# EAGLE design sapog_reference_hardware (EAGLE 7.1.0)

## Sheet 1 of 2: page1
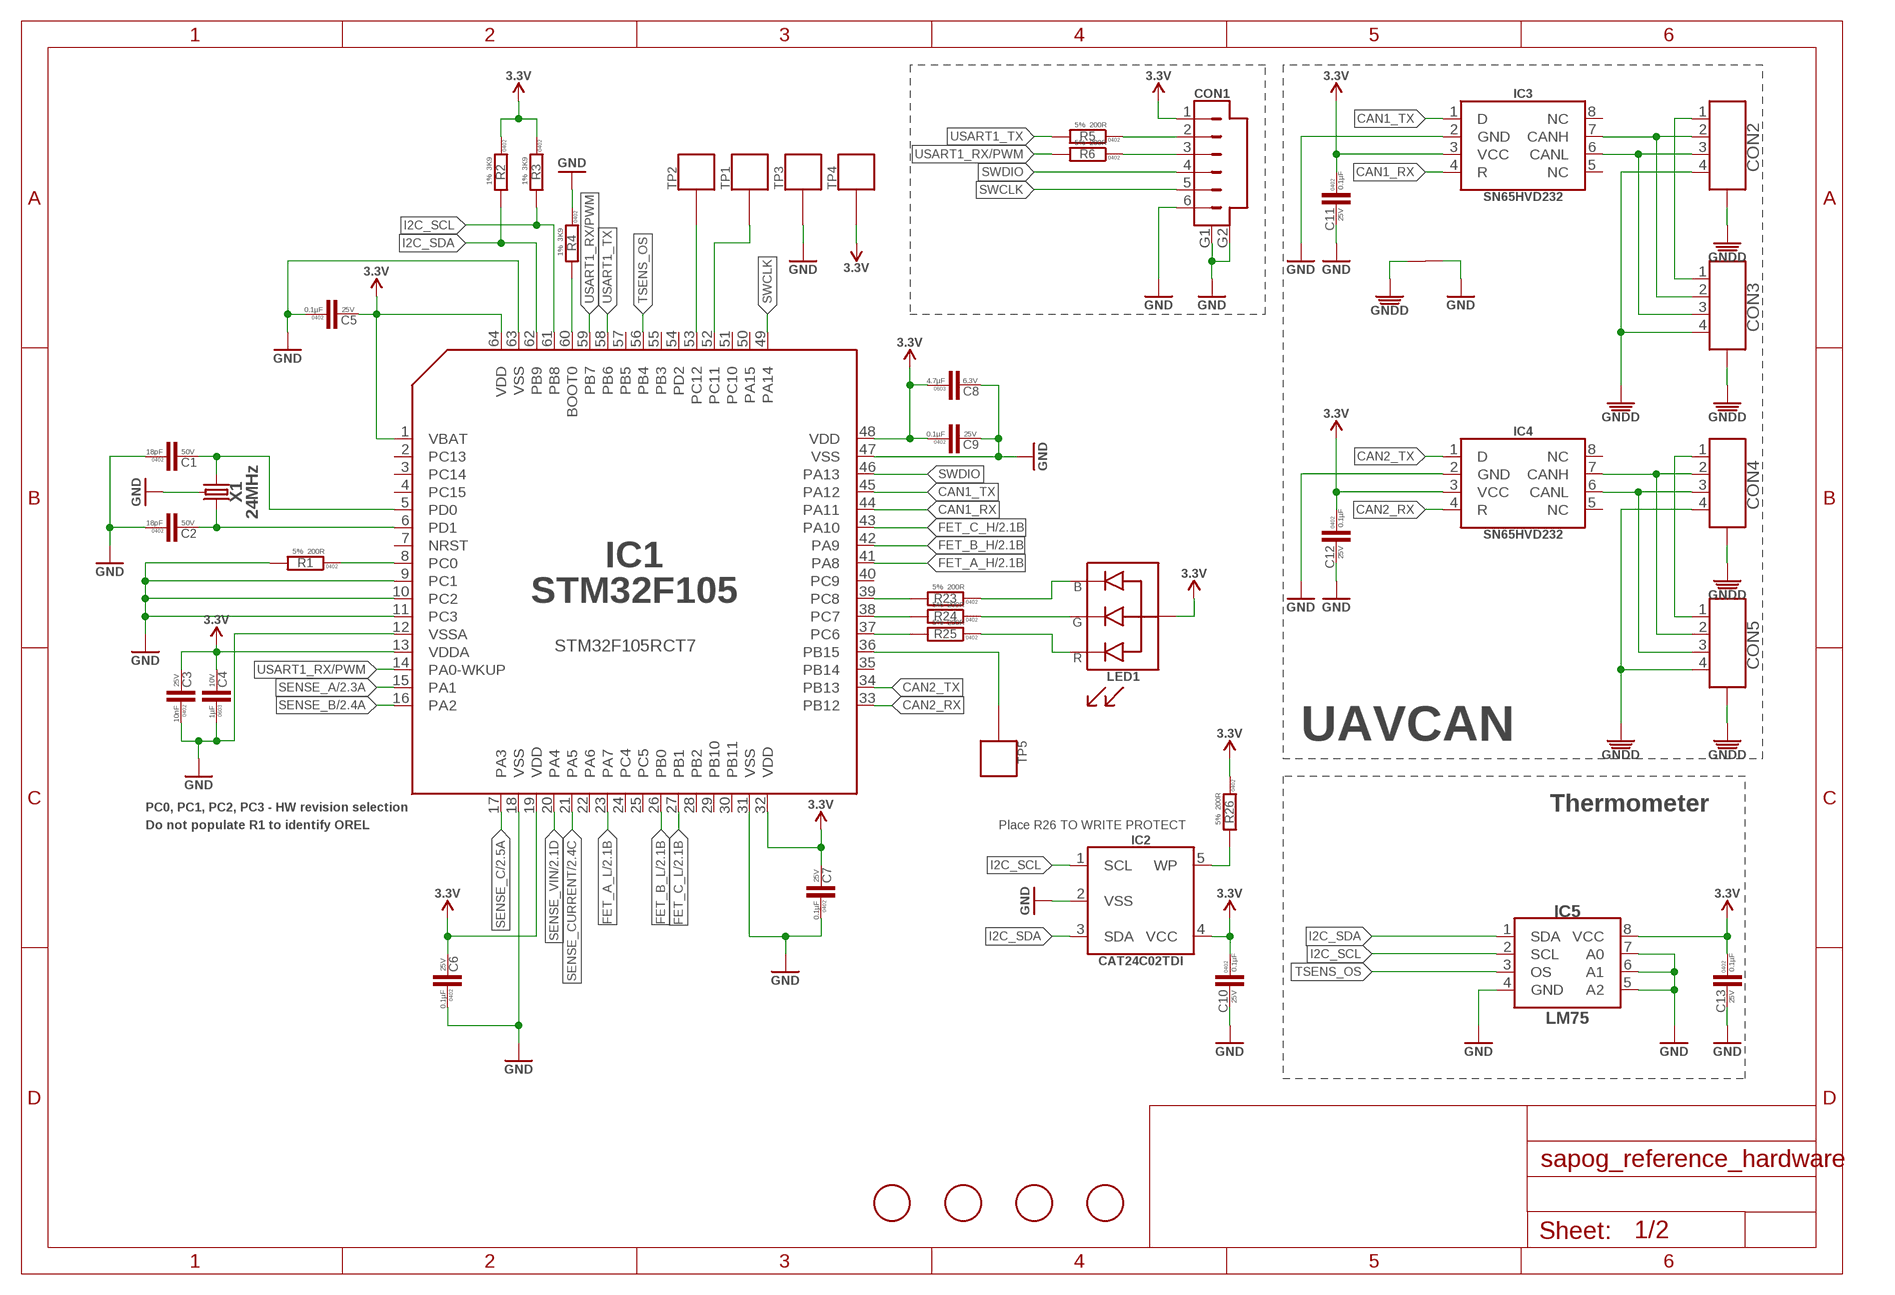
[diagram p0: schematic, sheet 1]

### Parts
C1  18pF  18PF-50V_5%_NP0-0402  [C0402]
C2  18pF  18PF-50V_5%_NP0-0402  [C0402]
C3  10nF  10NF-25V_10%_X7R-0402  [C0402]
C4  1µF  1µF-10V_10%_X7R-0603  [C0603]
C5  0.1µF  0.1µF-25V_20%_X6S-0402  [C0402]
C6  0.1µF  0.1µF-25V_20%_X6S-0402  [C0402]
C7  0.1µF  0.1µF-25V_20%_X6S-0402  [C0402]
C8  4.7µF  4.7µF-6.3V_10%_X7R-0603  [C0603]
C9  0.1µF  0.1µF-25V_20%_X6S-0402  [C0402]
C10  0.1µF  0.1µF-25V_20%_X6S-0402  [C0402]
C11  0.1µF  0.1µF-25V_20%_X6S-0402  [C0402]
C12  0.1µF  0.1µF-25V_20%_X6S-0402  [C0402]
C13  0.1µF  0.1µF-25V_20%_X6S-0402  [C0402]
CON1  SM06B-SRSS-TB  [SM06B]
CON2  CON-4P-RA-JST_GH  [JST_GH-4P-RA]
CON3  CON-4P-RA-JST_GH  [JST_GH-4P-RA]
CON4  CON-4P-RA-JST_GH  [JST_GH-4P-RA]
CON5  CON-4P-RA-JST_GH  [JST_GH-4P-RA]
FD1  FIDUCIALMOUNT  [FIDUCIA-MOUNT]
FD2  FIDUCIALMOUNT  [FIDUCIA-MOUNT]
FD3  FIDUCIALMOUNT  [FIDUCIA-MOUNT]
FD4  FIDUCIALMOUNT  [FIDUCIA-MOUNT]
IC1  STM32F105  [TQFP64-10X10]
IC2  CAT24C02  [SOT23-5L]
IC3  SN65HVD232D  [SOIC8]
IC4  SN65HVD232D  [SOIC8]
IC5  LM75BD-TSSOP8  [TSSOP8]
LED1  LTST-C19HE1WT  [LITE_ON_RGB_LED]
R1  200R  200R-5%-0402  [R0402]
R2  3K9  3K9-1%-0402  [R0402]
R3  3K9  3K9-1%-0402  [R0402]
R4  3K9  3K9-1%-0402  [R0402]
R5  200R  200R-5%-0402  [R0402]
R6  200R  200R-5%-0402  [R0402]
R23  200R  200R-5%-0402  [R0402]
R24  200R  200R-5%-0402  [R0402]
R25  200R  200R-5%-0402  [R0402]
R26  200R  200R-5%-0402  [R0402]
TP1  PAD.05  [PAD.05X.05]
TP2  PAD.05  [PAD.05X.05]
TP3  PAD.05  [PAD.05X.05]
TP4  PAD.05  [PAD.05X.05]
TP5  PAD.05  [PAD.05X.05]
U$2  CONNECTION  [CONNECTION]
X1  24MHz  CRYSTAL-3.2X2.5-4P  [OSCILLATOR-3.2X2.5]

### Nets
BOOT0: IC1.60(BOOT0) R4.2
CAN1_RX: IC1.44(PA11) IC3.4(R)
CAN1_TX: IC1.45(PA12) IC3.1(D)
CAN2_RX: IC1.33(PB12) IC4.4(R)
CAN2_TX: IC1.34(PB13) IC4.1(D)
FET_A_H: IC1.41(PA8) ; also sheet 2
FET_A_L: IC1.23(PA7) ; also sheet 2
FET_B_H: IC1.42(PA9) ; also sheet 2
FET_B_L: IC1.26(PB0) ; also sheet 2
FET_C_H: IC1.43(PA10) ; also sheet 2
FET_C_L: IC1.27(PB1) ; also sheet 2
GND: C1.1 C2.1 C3.1 C4.P$1 C5.1 C6.1 C7.1 C8.P$2 C9.2 C10.2 C11.2 C12.2 C13.2 CON1.6 CON1.G1 CON1.G2 IC1.9(PC1) IC1.10(PC2) IC1.11(PC3) IC1.12(VSSA) IC1.18(VSS) IC1.31(VSS) IC1.47(VSS) IC1.63(VSS) IC2.2(VSS) IC3.2(GND) IC4.2(GND) IC5.4(GND) IC5.5(A2) IC5.6(A1) IC5.7(A0) R1.2 R4.1 TP3.P$1 U$2.P$2 X1.2(GND) X1.4(GND) ; also sheet 2
GNDD: CON2.4 CON2.M$0(GND) CON2.M$1(GND) CON3.4 CON3.M$0(GND) CON3.M$1(GND) CON4.4 CON4.M$0(GND) CON4.M$1(GND) CON5.4 CON5.M$0(GND) CON5.M$1(GND) U$2.P$1
I2C_SCL: IC1.61(PB8) IC2.1(SCL) IC5.2(SCL) R3.2
I2C_SDA: IC1.62(PB9) IC2.3(SDA) IC5.1(SDA) R2.2
N$1: CON1.2 R5.1
N$2: CON1.3 R6.1
N$3: IC1.37(PC6) R25.2
N$6: LED1.B R23.1
N$7: LED1.R R25.1
N$9: IC1.8(PC0) R1.1
N$10: IC2.5(WP) R26.2
N$12: IC1.38(PC7) R24.2
N$16: C1.2 IC1.5(PD0) X1.3
N$18: IC1.39(PC8) R23.2
N$19: CON4.1 CON5.1
N$20: CON4.2 CON5.2 IC4.7(CANH)
N$21: C2.2 IC1.6(PD1) X1.1
N$22: CON2.1 CON3.1
N$23: CON2.2 CON3.2 IC3.7(CANH)
N$24: CON4.3 CON5.3 IC4.6(CANL)
N$25: CON2.3 CON3.3 IC3.6(CANL)
N$26: LED1.G R24.1
N$27: IC1.53(PC12) TP2.P$1
N$28: IC1.36(PB15) TP5.P$1
N$29: IC1.52(PC11) TP1.P$1
SENSE_A: IC1.15(PA1) ; also sheet 2
SENSE_B: IC1.16(PA2) ; also sheet 2
SENSE_C: IC1.17(PA3) ; also sheet 2
SENSE_CURRENT: IC1.21(PA5) ; also sheet 2
SENSE_VIN: IC1.20(PA4) ; also sheet 2
SWCLK: CON1.5 IC1.49(PA14)
SWDIO: CON1.4 IC1.46(PA13)
TSENS_OS: IC1.56(PB4) IC5.3(OS)
USART1_RX/PWM: IC1.14(PA0-WKUP) IC1.59(PB7) R6.2
USART1_TX: IC1.58(PB6) R5.2
VDD_3V3: C3.2 C4.P$2 C5.2 C6.2 C7.2 C8.P$1 C9.1 C10.1 C11.1 C12.1 C13.1 CON1.1 IC1.1(VBAT) IC1.13(VDDA) IC1.19(VDD) IC1.32(VDD) IC1.48(VDD) IC1.64(VDD) IC2.4(VCC) IC3.3(VCC) IC4.3(VCC) IC5.8(VCC) LED1.+(A) R2.1 R3.1 R26.1 TP4.P$1 ; supply symbol labelled 3.3V ; also sheet 2
Unconnected: IC1.2(PC13) IC1.3(PC14) IC1.4(PC15) IC1.7(NRST) IC1.22(PA6) IC1.24(PC4) IC1.25(PC5) IC1.28(PB2) IC1.29(PB10) IC1.30(PB11) IC1.35(PB14) IC1.40(PC9) IC1.50(PA15) IC1.51(PC10) IC1.54(PD2) IC1.55(PB3) IC1.57(PB5) IC3.5(NC) IC3.8(NC) IC4.5(NC) IC4.8(NC)

### Notes on the sheet
- STM32F105RCT7
- UAVCAN
- PC0, PC1, PC2, PC3 - HW revision selection | Thermometer
- Do not populate R1 to identify OREL | Place R26 TO WRITE PROTECT

## Sheet 2 of 2
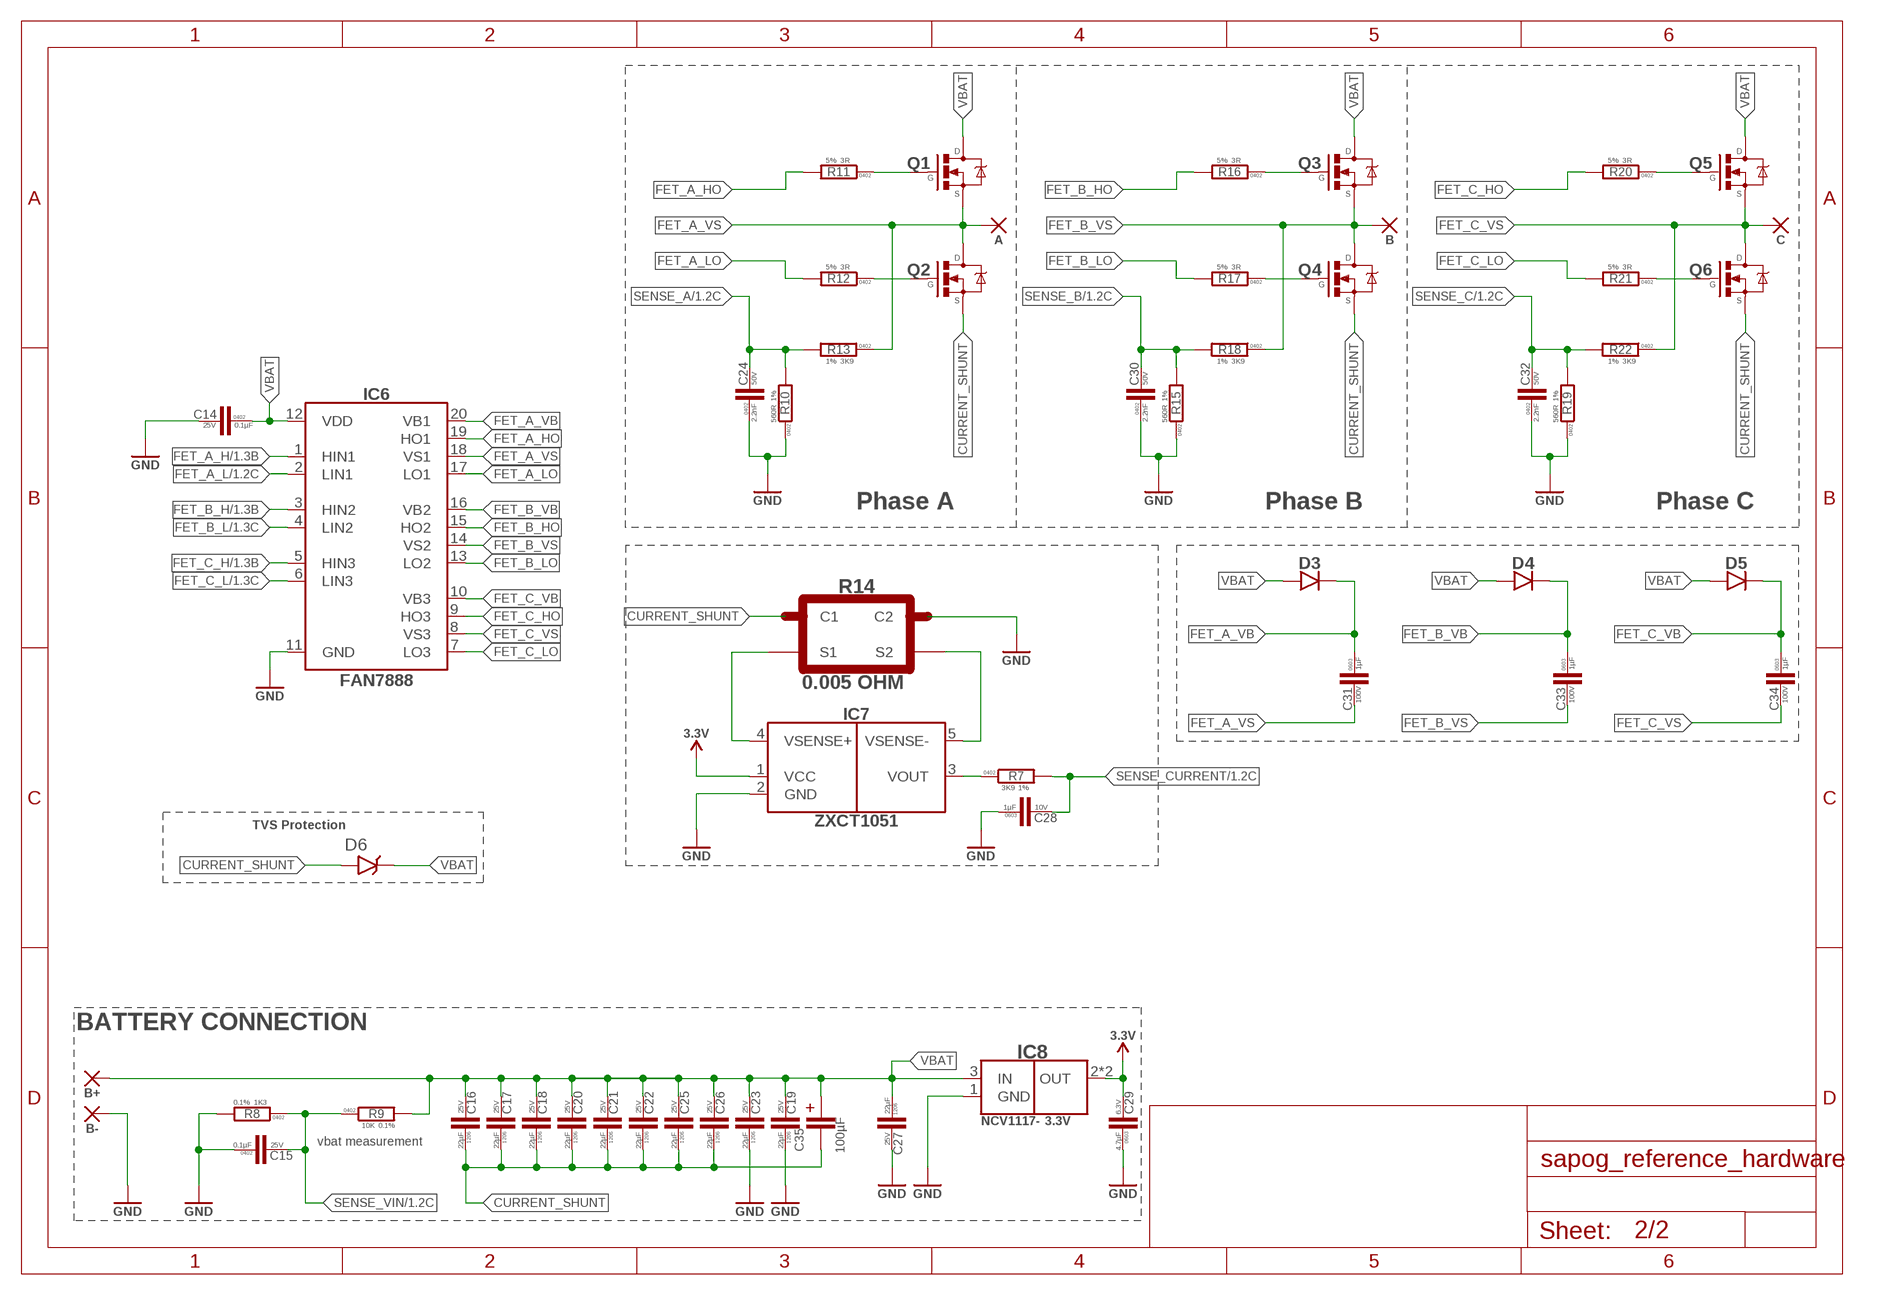
[diagram p1: schematic, sheet 2]

### Parts
A  WIREPADSMD5-2,5  [5-2,5]
B  WIREPADSMD5-2,5  [5-2,5]
B+  WIREPADSMD5-2,5  [5-2,5]
B-  WIREPADSMD5-2,5  [5-2,5]
C  WIREPADSMD5-2,5  [5-2,5]
C14  0.1µF  0.1µF-25V_20%_X6S-0402  [C0402]
C15  0.1µF  0.1µF-25V_20%_X6S-0402  [C0402]
C16  22µF  22µF-25V_10%_X6S-1206  [C1206]
C17  22µF  22µF-25V_10%_X6S-1206  [C1206]
C18  22µF  22µF-25V_10%_X6S-1206  [C1206]
C19  22µF  22µF-25V_10%_X6S-1206  [C1206]
C20  22µF  22µF-25V_10%_X6S-1206  [C1206]
C21  22µF  22µF-25V_10%_X6S-1206  [C1206]
C22  22µF  22µF-25V_10%_X6S-1206  [C1206]
C23  22µF  22µF-25V_10%_X6S-1206  [C1206]
C24  2.2nF  2.2NF-50V_10%_X7R-0402  [C0402]
C25  22µF  22µF-25V_10%_X6S-1206  [C1206]
C26  22µF  22µF-25V_10%_X6S-1206  [C1206]
C27  22µF  22µF-25V_10%_X6S-1206  [C1206]
C28  1µF  1µF-10V_10%_X7R-0603  [C0603]
C29  4.7µF  4.7µF-6.3V_10%_X7R-0603  [C0603]
C30  2.2nF  2.2NF-50V_10%_X7R-0402  [C0402]
C31  1µF  1µF-100V_10%_X7S-0603  [C0603]
C32  2.2nF  2.2NF-50V_10%_X7R-0402  [C0402]
C33  1µF  1µF-100V_10%_X7S-0603  [C0603]
C34  1µF  1µF-100V_10%_X7S-0603  [C0603]
C35  100µF  C-TANT-3024  [3024]
D3  BAS21AHT1G  [SOD323]
D4  BAS21AHT1G  [SOD323]
D5  BAS21AHT1G  [SOD323]
D6  1KSMB20A  [SMB]
IC6  FAN7888  [SOIC20]
IC7  ZXCT1051  [SOT23-5L]
IC8  3.3V  NCV1117-3.3  [SOT-223]
Q1  BSC019N04NS-DFN5X6  [DFN5X6]
Q2  BSC019N04NS-DFN5X6  [DFN5X6]
Q3  BSC019N04NS-DFN5X6  [DFN5X6]
Q4  BSC019N04NS-DFN5X6  [DFN5X6]
Q5  BSC019N04NS-DFN5X6  [DFN5X6]
Q6  BSC019N04NS-DFN5X6  [DFN5X6]
R7  3K9  3K9-1%-0402  [R0402]
R8  1K3  1K3-0.1%-0402  [R0402]
R9  10K  10K-0.1%-0402  [R0402]
R10  560R  560R-1%-0402  [R0402]
R11  3R  3R-5%-0402  [R0402]
R12  3R  3R-5%-0402  [R0402]
R13  3K9  3K9-1%-0402  [R0402]
R14  0.005 OHM  CURRENT_SHUNT-CSNL2010  [2010_CURRENT_SHUNT]
R15  560R  560R-1%-0402  [R0402]
R16  3R  3R-5%-0402  [R0402]
R17  3R  3R-5%-0402  [R0402]
R18  3K9  3K9-1%-0402  [R0402]
R19  560R  560R-1%-0402  [R0402]
R20  3R  3R-5%-0402  [R0402]
R21  3R  3R-5%-0402  [R0402]
R22  3K9  3K9-1%-0402  [R0402]

### Nets
BLABLA: IC7.3(VOUT) R7.1
CURRENT_SHUNT: C16.P$1 C17.P$1 C18.P$1 C20.P$1 C21.P$1 C22.P$1 C25.P$1 C26.P$1 C35.- D6.A Q2.1S(S) Q2.2S(S) Q2.3S(S) Q4.1S(S) Q4.2S(S) Q4.3S(S) Q6.1S(S) Q6.2S(S) Q6.3S(S) R14.CURRENT1(C1)
FET_A_H: IC6.1(HIN1) ; also sheet 1
FET_A_HO: IC6.19(HO1) R11.2
FET_A_L: IC6.2(LIN1) ; also sheet 1
FET_A_LO: IC6.17(LO1) R12.2
FET_A_VB: C31.P$1 D3.C IC6.20(VB1)
FET_A_VS: A.1(P) C31.P$2 IC6.18(VS1) Q1.1S(S) Q1.2S(S) Q1.3S(S) Q2.5D(D) Q2.6D(D) Q2.7D(D) Q2.8D(D) R13.1
FET_B_H: IC6.3(HIN2) ; also sheet 1
FET_B_HO: IC6.15(HO2) R16.2
FET_B_L: IC6.4(LIN2) ; also sheet 1
FET_B_LO: IC6.13(LO2) R17.2
FET_B_VB: C33.P$1 D4.C IC6.16(VB2)
FET_B_VS: B.1(P) C33.P$2 IC6.14(VS2) Q3.1S(S) Q3.2S(S) Q3.3S(S) Q4.5D(D) Q4.6D(D) Q4.7D(D) Q4.8D(D) R18.1
FET_C_H: IC6.5(HIN3) ; also sheet 1
FET_C_HO: IC6.9(HO3) R20.2
FET_C_L: IC6.6(LIN3) ; also sheet 1
FET_C_LO: IC6.7(LO3) R21.2
FET_C_VB: C34.P$1 D5.C IC6.10(VB3)
FET_C_VS: C34.P$2 C.1(P) IC6.8(VS3) Q5.1S(S) Q5.2S(S) Q5.3S(S) Q6.5D(D) Q6.6D(D) Q6.7D(D) Q6.8D(D) R22.1
GND: B-.1(P) C14.2 C15.1 C19.P$1 C23.P$1 C24.1 C27.P$2 C28.P$1 C29.P$1 C30.1 C32.1 IC6.11(GND) IC7.2(GND) IC8.1(GND) R8.2 R10.1 R14.CURRENT2(C2) R15.1 R19.1 ; also sheet 1
N$4: Q2.4G(G) R12.1
N$5: Q3.4G(G) R16.1
N$8: Q4.4G(G) R17.1
N$11: Q5.4G(G) R20.1
N$13: IC7.5(VSENSE-) R14.SENSE2(S2)
N$14: Q1.4G(G) R11.1
N$15: IC7.4(VSENSE+) R14.SENSE1(S1)
N$17: Q6.4G(G) R21.1
SENSE_A: C24.2 R10.2 R13.2 ; also sheet 1
SENSE_B: C30.2 R15.2 R18.2 ; also sheet 1
SENSE_C: C32.2 R19.2 R22.2 ; also sheet 1
SENSE_CURRENT: C28.P$2 R7.2 ; also sheet 1
SENSE_VIN: C15.2 R8.1 R9.1 ; also sheet 1
VBAT: B+.1(P) C14.1 C16.P$2 C17.P$2 C18.P$2 C19.P$2 C20.P$2 C21.P$2 C22.P$2 C23.P$2 C25.P$2 C26.P$2 C27.P$1 C35.+ D3.A D4.A D5.A D6.C IC6.12(VDD) IC8.3(IN) Q1.5D(D) Q1.6D(D) Q1.7D(D) Q1.8D(D) Q3.5D(D) Q3.6D(D) Q3.7D(D) Q3.8D(D) Q5.5D(D) Q5.6D(D) Q5.7D(D) Q5.8D(D) R9.2
VDD_3V3: C29.P$2 IC7.1(VCC) IC8.2(OUT) IC8.4(OUT) ; supply symbol labelled 3.3V ; also sheet 1

### Notes on the sheet
- Phase A | Phase B | Phase C
- TVS Protection
- BATTERY CONNECTION
- vbat measurement

## Library data of the parts
A B B+ B- C = valenok_master_library:WIREPAD: Wire PAD connect wire on PCB
C1 C2 = C_digikey:18PF; DIGIKEY#: 399-8828-1-ND; MANF: Kemet; MANF#: CBR04C180F5GAC; OPERATING_TEMP: -55°C ~ 125°C; PACKAGE: 0402; TC: C0G, NP0; TOLERANCE: +-1%; VOLTAGE: 50V
C3 = C_digikey:10NF; DIGIKEY#: 490-1312-1-ND; MANF: Murata Electronics North America; MANF#: GRM155R71E103KA01D; OPERATING_TEMP: -55°C ~ 125°C; PACKAGE: 0402; TC: X7R; TOLERANCE: +-10%; VOLTAGE: 25V
C4 C28 = C_digikey:1µF; DIGIKEY#: 587-1242-1-ND; MANF: Taiyo Yuden; MANF#: LMK107B7105KA-T; OPERATING_TEMP: -55°C ~ 125°C; PACKAGE: 0603; TC: X7R; TOLERANCE: +-10%; VOLTAGE: 10V
C5-C7 C9-C15 = C_digikey:0.1µF; DIGIKEY#: 445-7361-1-ND; MANF: TDK Corporation; MANF#: C1005X6S1E104M050BB; OPERATING_TEMP: -55°C ~ 105°C; PACKAGE: 0402; TC: X6S; TOLERANCE: +-20%; VOLTAGE: 25V
C8 C29 = C_digikey:4.7µF; DIGIKEY#: 1276-2087-1-ND; MANF: Samsung Electro-Mechanics America; MANF#: CL10B475KQ8NQNC; OPERATING_TEMP: -55°C ~ 125°C; PACKAGE: 0603; TC: X7R; TOLERANCE: +-10%; VOLTAGE: 6.3V
C16-C23 C25-C27 = C_digikey:22µF; DIGIKEY#: 1276-3299-1-ND; MANF: Samsung Electro-Mechanics America; MANF#: CL31X226KAHN3NE; OPERATING_TEMP: -55°C ~ 105°C; PACKAGE: 1206; TC: X6S; TOLERANCE: +-10%; VOLTAGE: 25V
C24 C30 C32 = C_digikey:2.2NF; DIGIKEY#: 478-1105-1-ND; MANF: AVX Corporation; MANF#: 04025C222KAT2A; OPERATING_TEMP: -55°C ~ 125°C; PACKAGE: 0402; TC: X7R; TOLERANCE: +-10%; VOLTAGE: 50V
C31 C33 C34 = C_digikey:1µF; DIGIKEY#: 445-5205-1-ND; MANF: TDK Corporation; MANF#: C2012X7S2A105K125AB; OPERATING_TEMP: -55°C ~ 125°C; PACKAGE: 0603; TC: X7S; TOLERANCE: +-10%; VOLTAGE: 100V
C35 = sapog_reference_hardware:C-TANT: Tantalum capacitor; DIGIKEY#: 718-1942-1-ND; MANF: Vishay Sprague; MANF#: 597D107X0035F2T; OPERATING_TEMPERATURE: -55°C ~ 125°C; VOLTAGE: 35V
CON1 = sapog_reference_hardware:SM06B-SRSS-TB: CONN HEADER SH 6POS SIDE 1MM TIN; DIGIKEY#: 455-1806-1-ND; MANF: JST Sales America Inc; MANF#: SM06B-SRSS-TB(LF)(SN); PARTNO: SM06B-SRSS-TB
CON2-CON5 = sapog_reference_hardware:CON-4P-RA: Connector Receptacle 4 Position 0.049" (1.25mm) Tin Surface Mount, Right Angle; DIGIKEY#: 455-1566-1-ND; MANF: JST Sales America Inc; MANF#: SM04B-GHS-TB(LF)(SN)-
D3-D5 = valenok_master_library:BAS21AHT1G: DIODE GEN PURP 250V 200MA SOD323; DIGIKEY#: BAS21AHT1GOSCT-ND; MANF: ON Semiconductor; MANF#: BAS21AHT1G
D6 = sapog_reference_hardware:1KSMB20A: TVS DIODE 17.1VWM 27.7VC SMD; DIGIKEY#: 1KSMB20ACT-ND; MANF: Littelfuse Inc; MANF#: 1KSMB20A
FD1-FD4 = sapog_reference_hardware:FIDUCIALMOUNT
IC1 = sapog_reference_hardware:STM32F105: MCU ARM 256KB FLASH MEM 64-LQFP; DIGIKEY#: 497-11547-ND; MANF: STMicroelectronics; MANF#: STM32F105RCT7; OPERATING_TEMP: -40°C ~ 105°C (TA)
IC2 = sapog_reference_hardware:CAT24C02: IC EEPROM 2KBIT 400KHZ TSOT23-5; DIGIKEY#: CAT24C02TDI-GT3AOSCT-ND; MANF: ON Semiconductor; MANF#: CAT24C02TDI-GT3A
IC3 IC4 = sapog_reference_hardware:SN65HVD232D: IC CAN TRANSCEIVER 3.3V 8-SOIC; DIGIKEY#: 296-26344-1-ND; MANF: Texas Instruments; MANF#: SN65HVD232DR
IC5 = sapog_reference_hardware:LM75BD: SENSOR TEMPERATURE I2C 8TSSOP; DIGIKEY#: 568-4768-1-ND; MANF: NXP Semiconductors; MANF#: LM75BDP,118
IC6 = sapog_reference_hardware:FAN7888: IC GATE DRIVER HALF BRIDG 20SOIC; DIGIKEY#: FAN7888MXTR-ND; MANF: Fairchild Semiconductor; MANF#: FAN7888MX; PARTNO: FAN7888MX
IC7 = sapog_reference_hardware:ZXCT1051: IC CURRENT MONITOR 1% SOT23-5; DIGIKEY#: ZXCT1051E5CT-ND; MANF: Diodes Incorporated; MANF#: ZXCT1051E5TA
IC8 = sapog_reference_hardware:NCV1117-3.3: IC REG LDO 3.3V 1A SOT223; DIGIKEY#: NCV1117ST33T3GOSCT-ND; MANF: ON Semiconductor; MANF#: NCV1117ST33T3G
LED1 = sapog_reference_hardware:LTST-C19HE1WT; DIGIKEY#: 160-2162-1-ND; MANF#: LTST-C19HE1WT
Q1-Q6 = sapog_reference_hardware:BSC019N04NS; DIGIKEY#: BSC019N04NS GTR-ND; MANF: Infineon Technologies; MANF#: BSC019N04NS G
R1 = R_digikey:200R; ASSEMBLY: DNM; DIGIKEY#: 311-200JRCT-ND; MANF: Yageo; MANF#: RC0402JR-07200RL; PACKAGE: 0402; TOLERANCE: 5%
R2-R4 R7 R13 R18 R22 = R_digikey:3K9; DIGIKEY#: 311-3.90KLRCT-ND; MANF: Yageo; MANF#: RC0402FR-073K9L; PACKAGE: 0402; TOLERANCE: 1%
R5 R6 R23-R25 = R_digikey:200R; DIGIKEY#: 311-200JRCT-ND; MANF: Yageo; MANF#: RC0402JR-07200RL; PACKAGE: 0402; PARTNO: RC0402FR-07240RL; TOLERANCE: 5%
R8 = R_digikey:1K3; DIGIKEY#: P1.3KDCCT-ND; MANF: Panasonic Electronic Components; MANF#: ERA-2AEB132X; PACKAGE: 0402; TOLERANCE: 0.1%
R9 = R_digikey:10K; DIGIKEY#: P10KDCCT-ND; MANF: Panasonic Electronic Components; MANF#: ERA-2AEB103X; PACKAGE: 0402; TOLERANCE: 0.1%
R10 R15 R19 = R_digikey:560R; DIGIKEY#: 541-560LCT-ND; MANF: Vishay Dale; MANF#: CRCW0402560RFKED; PACKAGE: 0402; TOLERANCE: 1%
R11 R12 R16 R17 R20 R21 = R_digikey:3R; DIGIKEY#: P3.0JCT-ND; MANF: Panasonic Electronic Components; MANF#: ERJ-2GEJ3R0X; PACKAGE: 0402; TOLERANCE: 5%
R14 = sapog_reference_hardware:CURRENT_SHUNT-: RES SMD 0.005 OHM 1% 1.5W 2010; DIGIKEY#: CSNL2010FT5L00CT-ND; MANF: Stackpole Electronics Inc; MANF#: CSNL2010FT5L00; POWER: 1.5W; TOLERANCE: 1%
R26 = R_digikey:200R; ASSEMBLY: DNM; DIGIKEY#: 311-200JRCT-ND; MANF: Yageo; MANF#: RC0402JR-07200RL; PACKAGE: 0402; PARTNO: RC0402FR-07240RL; TOLERANCE: 5%
TP1-TP5 = pixhawk2:PAD: Test pad This footprint includes three classes: The actual test pads, a pogo-pin footprint to mount the pogo-pin as through-hole part and a hole footprint which allows the head of the pogo-pin to pass through (do NOT use the hole to mount the pogo-pin). In a typical test setup, the stack would consist of three PCBs: The actual PCB under testing with a test pad on the bottom, then a second PCB with the hole for the pogo-pin head where the PCB under testing is pressed on and a third PCB at 30 mm / 1.2" distance with the pogo-pin footprints. The pogo-pins are soldered to the last PCB. To create the stack, copy the board under testing and exchange the footprints - this way the correct positioning is ensured.; BOM: EXCLUDE; PARTNO: *
U$2 = GNSS2_master_lib:CONNECTION; BOM: EXCLUDE
X1 = GNSS2_master_lib:CRYSTAL: Smd Crystal; DIGIKEY#: 1253-1198-1-ND; MANF: AVX Corp/Kyocera Corp; MANF#: CX3225GB24000P0HPQCC; VALUE: 16MHz

## Net classes
1 power: width 0.15 mm, drill 0.2 mm, clearance 0.152 mm

## Board
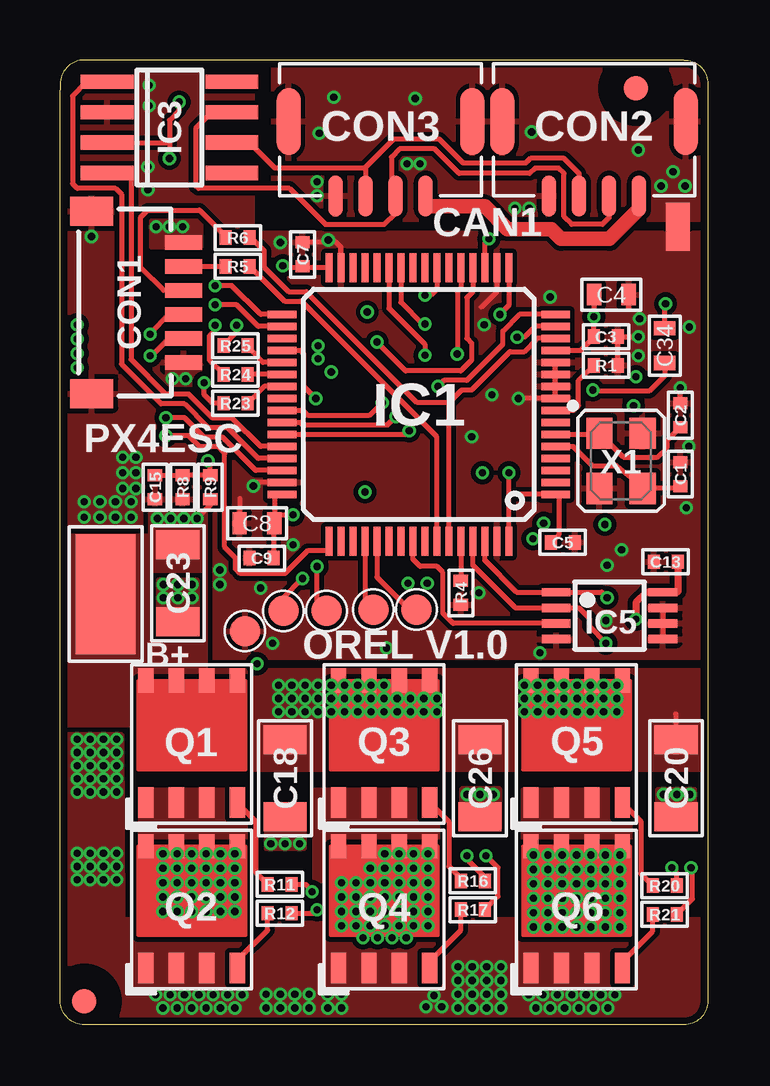
[diagram p2: board, top side]
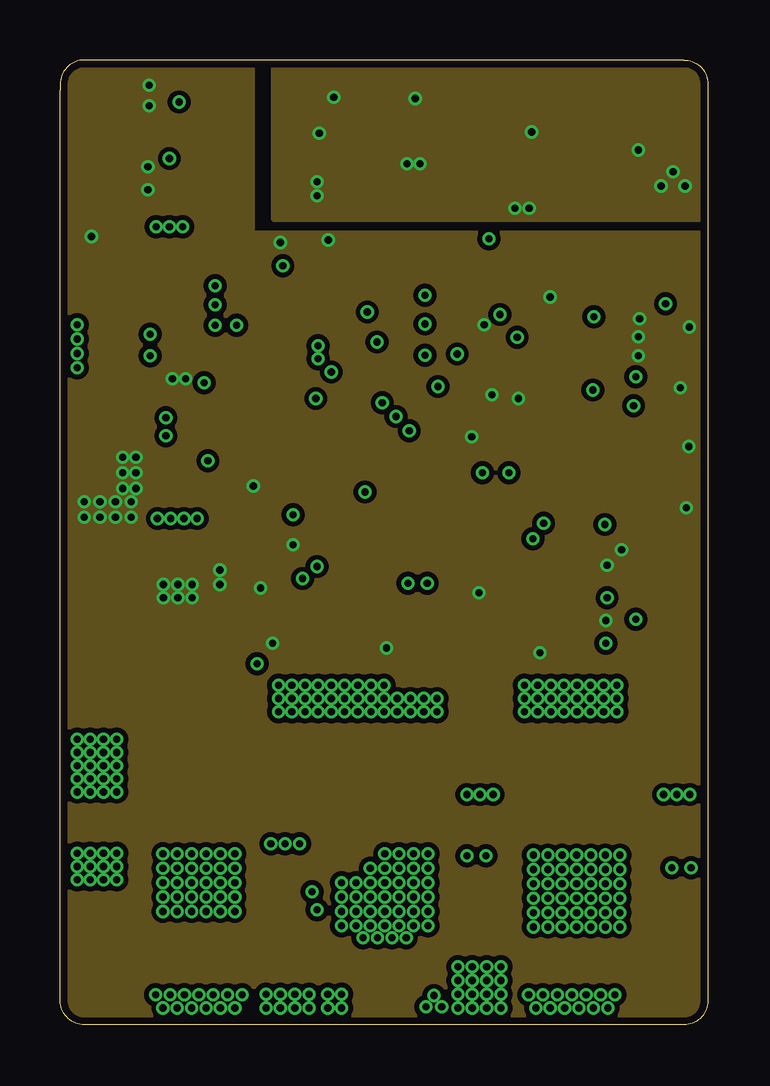
[diagram p3: board, inner layer gnd]
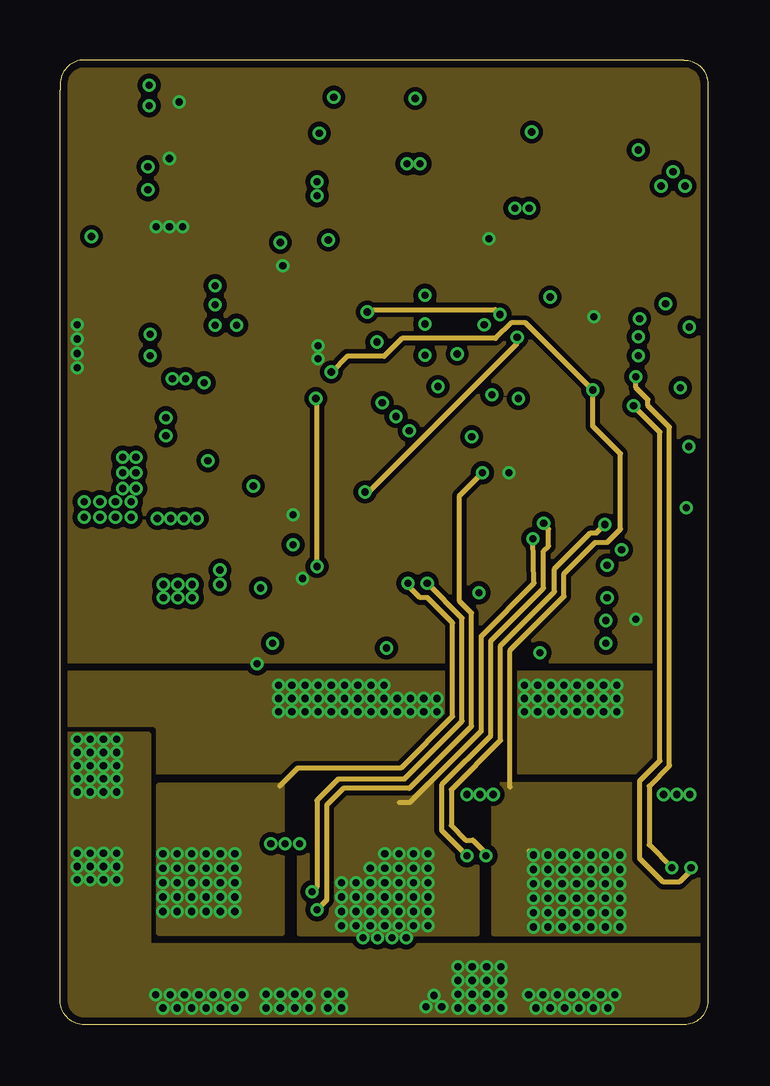
[diagram p4: board, inner layer SUPPLY]
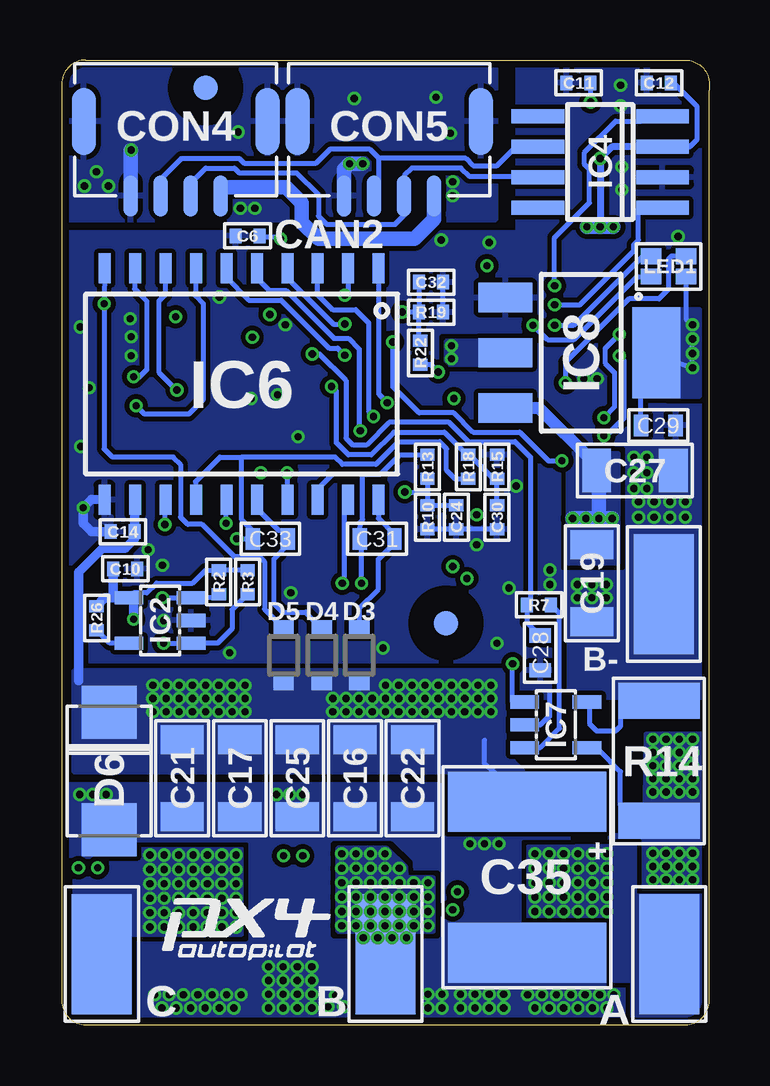
[diagram p5: board, bottom side, seen from below]

Size 27 x 40.2 mm. Coordinates in mm from the lower left corner, seen from the top.
Copper layers (1+2*3+16): Top 0.035mm / dielectric 0.5mm / gnd 0.035mm / dielectric 0.5mm / SUPPLY 0.035mm / dielectric 0.2mm / Bottom 0.035mm
Design rules "px_4layer_corrected *": minimum track width 6mil, minimum drill 0.2mm, track to track 0.2mm, track to pad 0.2mm, pad to pad 0.2mm, via to via 0.2mm, smd to smd 0.15mm, copper to edge 0.3mm, drill to drill 0.2mm, minimum pad ring 0.125mm, minimum via ring 0.125mm, stop-mask expansion 1mil, vias tented up to drill 0.31mm, thermal gap 8mil

### Footprints (pad centres in the part's own frame; a part is rotated, then mirrored left to right if it is on the bottom)
5-2,5 = smd 2.5 x 5: 1 0,0
C0402 = smd 0.5 x 0.6: 1 -0.5,0; 2 0.5,0
C0603 = smd 0.6 x 0.9: P$1 -0.725,0; P$2 0.725,0
C1206 = smd 1.2 x 1.8: P$1 -1.6,0; P$2 1.6,0
3024 = smd 2.5 x 6.6: + -3.15,0; - 3.15,0
SM06B = smd 0.6 x 1.55: 1 -2.5,2.275; 2 -1.5,2.275; 3 -0.5,2.275; 4 0.5,2.275; 5 1.5,2.275; 6 2.5,2.275 | smd 1.2 x 1.8: G1 -3.8,-1.55; G2 3.8,-1.55
JST_GH-4P-RA = smd 0.6 x 1.7: 1 1.875,-2.91; 2 0.625,-2.91; 3 -0.625,-2.91; 4 -1.875,-2.91 | smd 1 x 2.8: M$0 -3.825,0.19; M$1 3.825,0.19
SOD323 = smd 0.65 x 0.85: A 1.125,0; C -1.125,0
SMB = smd 2.2 x 2.3: A -2.45,0; C 2.45,0
FIDUCIA-MOUNT = smd 1.016 x 1.016: P$1 0,0
TQFP64-10X10 = smd 1.2 x 0.3: 1 -5.7,3.75; 2 -5.7,3.25; 3 -5.7,2.75; 4 -5.7,2.25; 5 -5.7,1.75; 6 -5.7,1.25; 7 -5.7,0.75; 8 -5.7,0.25; 9 -5.7,-0.25; 10 -5.7,-0.75; 11 -5.7,-1.25; 12 -5.7,-1.75; 13 -5.7,-2.25; 14 -5.7,-2.75; 15 -5.7,-3.25; 16 -5.7,-3.75; 33 5.7,-3.75; 34 5.7,-3.25; 35 5.7,-2.75; 36 5.7,-2.25; 37 5.7,-1.75; 38 5.7,-1.25; 39 5.7,-0.75; 40 5.7,-0.25; 41 5.7,0.25; 42 5.7,0.75; 43 5.7,1.25; 44 5.7,1.75; 45 5.7,2.25; 46 5.7,2.75; 47 5.7,3.25; 48 5.7,3.75 | smd 0.3 x 1.2: 17 -3.75,-5.7; 18 -3.25,-5.7; 19 -2.75,-5.7; 20 -2.25,-5.7; 21 -1.75,-5.7; 22 -1.25,-5.7; 23 -0.75,-5.7; 24 -0.25,-5.7; 25 0.25,-5.7; 26 0.75,-5.7; 27 1.25,-5.7; 28 1.75,-5.7; 29 2.25,-5.7; 30 2.75,-5.7; 31 3.25,-5.7; 32 3.75,-5.7; 49 3.75,5.7; 50 3.25,5.7; 51 2.75,5.7; 52 2.25,5.7; 53 1.75,5.7; 54 1.25,5.7; 55 0.75,5.7; 56 0.25,5.7; 57 -0.25,5.7; 58 -0.75,5.7; 59 -1.25,5.7; 60 -1.75,5.7; 61 -2.25,5.7; 62 -2.75,5.7; 63 -3.25,5.7; 64 -3.75,5.7
SOT23-5L = smd 0.55 x 1.2: 1 -0.95,-1.3; 2 0,-1.3; 3 0.95,-1.3; 4 0.95,1.3; 5 -0.95,1.3
SOIC8 = smd 2.2 x 0.6: 1 -2.6,1.905; 2 -2.6,0.635; 3 -2.6,-0.635; 4 -2.6,-1.905; 5 2.6,-1.905; 6 2.6,-0.635; 7 2.6,0.635; 8 2.6,1.905
TSSOP8 = smd 1.2 x 0.35: 1 -2.225,0.975; 2 -2.225,0.325; 3 -2.225,-0.325; 4 -2.225,-0.975; 5 2.225,-0.975; 6 2.225,-0.325; 7 2.225,0.325; 8 2.225,0.975
SOIC20 = smd 1.25 x 0.5: 1 -4.826,5.715; 2 -4.826,4.445; 3 -4.826,3.175; 4 -4.826,1.905; 5 -4.826,0.635; 6 -4.826,-0.635; 7 -4.826,-1.905; 8 -4.826,-3.175; 9 -4.826,-4.445; 10 -4.826,-5.715; 11 4.826,-5.715; 12 4.826,-4.445; 13 4.826,-3.175; 14 4.826,-1.905; 15 4.826,-0.635; 16 4.826,0.635; 17 4.826,1.905; 18 4.826,3.175; 19 4.826,4.445; 20 4.826,5.715
SOT-223 = smd 1.219 x 2.235: 1 -2.3,-3.15; 2 0,-3.15; 3 2.3,-3.15 | smd 3.8 x 2: 4 0,3.15
LITE_ON_RGB_LED = smd 0.65 x 0.85: + -0.425,-0.725; B 0.425,-0.725; G 0.425,0.725; R -0.425,0.725
DFN5X6 = smd 1.27 x 0.635: 1S -2.54,1.905; 2S -2.54,0.635; 3S -2.54,-0.635; 4G -2.54,-1.905 | smd 1.02 x 0.635: 5D 2.54,-1.905; 6D 2.54,-0.635; 7D 2.54,0.635; 8D 2.54,1.905
R0402 = smd 0.5 x 0.6: 1 -0.5,0; 2 0.5,0
2010_CURRENT_SHUNT = smd 1.5 x 3.4: CURRENT1 -2.5,0; CURRENT2 2.5,0 | smd 0.2 x 0.2: SENSE1 -1.85,1.6; SENSE2 1.85,1.6
PAD.05X.05 = smd 1.27 x 1.27: P$1 0,0
CONNECTION = smd 1 x 1: P$1 -0.5,0; P$2 0.5,0
OSCILLATOR-3.2X2.5 = smd 1.3 x 1.1: 1 -1.15,-0.9; 2 1.15,-0.9; 3 1.15,0.9; 4 -1.15,0.9

### Placement (x,y rotation side)
A  1.68,2.95 180 bottom
B  13.5,2.95 0 bottom
B+  1.89,17.95 0 top
B-  1.9,17.95 0 bottom
C  25.32,2.95 0 bottom
C1  25.85,22.95 270 top
C2  25.85,25.4 270 top
C3  22.75,28.68 180 top
C4  22.98,30.43 180 top
C5  20.95,20.1 180 top
C6  19.25,32.88 0 bottom
C7  10.1,32.1 270 top
C8  8.2,20.9 180 top
C9  8.4,19.45 180 top
C10  24.35,19 0 bottom
C11  5.45,39.25 180 bottom
C12  2.1,39.25 180 bottom
C13  25.24,19.29 180 top
C14  24.45,20.55 180 bottom
C15  3.95,22.4 90 top
C16  14.78,10.28 90 bottom
C17  19.57,10.28 90 bottom
C18  9.38,10.28 90 top
C19  4.9,18.4 90 bottom
C20  25.68,10.28 90 top
C21  21.98,10.28 90 bottom
C22  12.38,10.28 90 bottom
C23  4.9,18.4 90 top
C24  10.55,21.15 90 bottom
C25  17.18,10.28 90 bottom
C26  17.5,10.28 90 top
C27  3.1,23.1 0 bottom
C28  7.05,15.5 90 bottom
C29  2.12,24.98 180 bottom
C30  8.85,21.15 90 bottom
C31  13.85,20.25 180 bottom
C32  11.6,30.95 180 bottom
C33  18.3,20.25 180 bottom
C34  25.2,28.3 270 top
C35  7.6,6.15 270 bottom
CON1  2.86,30.1 270 top
CON2  22.25,37.45 0 top
CON3  13.35,37.45 0 top
CON4  22.25,37.45 0 bottom
CON5  13.35,37.45 0 bottom
D3  14.6,15.4 270 bottom
D4  16.15,15.4 270 bottom
D5  17.75,15.4 270 bottom
D6  25.02,10.57 90 bottom
FD1  24,39.02 0 top
FD2  1,0.97 0 top
FD3  21,39.05 0 bottom
FD4  10.97,16.73 0 bottom
IC1  14.95,25.85 180 top
IC2  22.9,16.85 90 bottom
IC3  4.55,37.39 0 top
IC4  4.55,35.95 180 bottom
IC5  22.9,17.05 0 top
IC6  19.5,26.7 270 bottom
IC7  6.4,12.5 270 bottom
IC8  5.35,28 270 bottom
LED1  1.7,31.6 90 bottom
Q1  5.47,11.8 90 top
Q2  5.47,4.9 90 top
Q3  13.5,11.8 90 top
Q4  13.5,4.9 90 top
Q5  21.52,11.8 90 top
Q6  21.52,4.9 90 top
R1  22.75,27.48 0 top
R2  20.45,18.45 270 bottom
R3  19.25,18.45 270 bottom
R4  16.7,18 90 top
R5  7.4,31.6 0 top
R6  7.4,32.8 0 top
R7  7.1,17.5 180 bottom
R8  5.1,22.4 270 top
R9  6.25,22.4 270 top
R10  11.75,21.15 90 bottom
R11  9.15,5.85 0 top
R12  9.15,4.65 0 top
R13  11.75,23.25 270 bottom
R14  2.1,11 90 bottom
R15  8.85,23.25 270 bottom
R16  17.2,6 0 top
R17  17.2,4.8 0 top
R18  10.05,23.25 90 bottom
R19  11.6,29.7 180 bottom
R20  25.2,5.8 0 top
R21  25.2,4.6 0 top
R22  12.05,28 90 bottom
R23  7.3,25.9 0 top
R24  7.3,27.1 0 top
R25  7.3,28.3 0 top
R26  25.55,16.95 270 bottom
TP1  13.05,17.3 0 top
TP2  14.85,17.3 0 top
TP3  7.7,16.4 0 top
TP4  9.3,17.25 0 top
TP5  11.1,17.25 0 top
U$1  [REF_BOARD_OUTLINE]  0,0 0 top
U$2  25.75,33.25 270 top
U$3  [PX4-LOGO-7MM]  22.8,2.8 0 bottom
X1  23.38,23.5 270 top

### Tracks (layer width: path | path; a pad name or v marks a point on that pad's centre or on a via)
BLABLA
  Bottom 0.2: IC7.3 7.05,11.55 6.25,12.35 6.25,17.15 R7.1
BOOT0
  Top 0.2: IC1.60 R4.2
CAN1_RX
  Top 0.2: IC1.44 8.35,24.1 7.15,25.3 6.33,25.3 5.35,26.27 4.4,26.27 2.95,27.73 2.95,35.4 1.95,35.4 IC3.4
CAN1_TX
  Top 0.2: IC1.45 8.25,23.6 6.95,24.9 6.15,24.9 5.17,25.88 4.2,25.88 2.55,27.52 2.55,34.6 2.3,34.85 0.71,34.85 0.51,35.05 0.51,38.7 1.1,39.3 IC3.1
CAN2_RX  (via drill 0.3)
  Top 0.2: IC1.33 8.35,29.6 7.15,30.8 v6.45,30.8
  Bottom 0.2: v6.45,30.8 6.45,32.8 5,34.25 5,35.65 5.2,35.85 5.2,36.35 3.9,37.65 2.85,37.65 2.85,37.85 IC4.4
CAN2_TX  (via drill 0.3)
  Top 0.2: IC1.34 8.25,29.1 7.35,30 v6.45,30
  Bottom 0.2: IC4.1 2.9,34.05 2.95,33.99 2.95,32.7 3.15,32.5 3.15,32.25 5.4,30 v6.45,30
CURRENT_SHUNT  (via drill 0.3)
  Top 0.2: C26.P$1 17.55,8.75
  other vias: 3.98,1.25 4.58,1.25 5.17,1.25 5.78,1.25 6.38,1.25 6.97,1.25 7.58,1.25 4.28,0.7 4.88,0.7 5.47,0.7 6.08,0.7 6.67,0.7 7.28,0.7 11.72,1.27 11.72,0.7 10.38,1.27 10.38,0.7 11.15,1.27 11.15,0.7 19.52,1.25 20.12,1.25 20.73,1.25 21.32,1.25 21.93,1.25 22.52,1.25 23.12,1.25 19.82,0.7 20.43,0.7 21.02,0.7 21.62,0.7 22.23,0.7 22.82,0.7 15.57,1.23 15.9,0.75 15.25,0.75 26.25,9.6 16.95,9.6 9.78,1.27 9.78,0.7 8.57,1.27 8.57,0.7 9.18,1.27 9.18,0.7 18.38,1.27 18.38,0.7 18.38,1.85 18.38,2.42 17.77,1.27 17.77,0.7 17.77,1.85 17.77,2.42 16.57,1.27 16.57,0.7 16.57,1.85 16.57,2.42 17.18,1.27 17.18,0.7 17.18,1.85 17.18,2.42 25.7,9.6 25.15,9.6 17.5,9.6 18.05,9.6 0.7,7.15 1.25,7.15 1.8,7.15 2.35,7.15 0.7,6.6 1.25,6.6 1.8,6.6 2.35,6.6 0.7,6.05 1.25,6.05 1.8,6.05 2.35,6.05 8.78,7.55 9.38,7.55 9.97,7.55 0.7,10.8 1.25,10.8 1.8,10.8 1.8,11.35 1.25,11.35 0.7,11.35 0.7,11.9 1.25,11.9 1.8,11.9 2.35,11.9 0.7,10.25 1.25,10.25 1.8,10.25 2.35,10.25 2.35,10.8 2.35,11.35 0.7,9.7 1.25,9.7 1.8,9.7 2.35,9.7
  pour Top (rank 3, no thermals): 0,0 -0.05,12.1 2.55,12.1 2.6,4.4 27,4.4 27,0
  pour Bottom (rank 3, no thermals): 0,0 -0.1,12.1 2.65,12.1 2.7,7.9 11.2,7.85 11.2,10 26.95,10 26.95,0
  pour Top (no thermals): 26.45,8.2 26.45,9.8 24.9,9.8 24.9,8.2
  pour Top (no thermals): 16.75,8.15 16.75,9.85 18.3,9.85 18.3,8.15
  pour SUPPLY: 0,0 27,0 27,3.3 3.7,3.3 3.7,12.1 0,12.1
  pour Bottom (no thermals): 2.55,8 0.5,8 0.5,5.85 2.55,5.85
  pour Top (no thermals): 8.57,8.6 8.57,7.35 10.18,7.35 10.18,8.6
FET_A_H  (via drill 0.3)
  Top 0.2: 13.1,25.6 v13.43,25.93 12.9,25.4 10.3,25.4 10.1,25.6 IC1.41
  Bottom 0.2: v13.43,25.93 13.78,26.28 13.78,31.52 IC6.1
FET_A_HO  (via drill 0.3)
  Top 0.2: R11.2 10.22,5.85 v10.5,5.55
  SUPPLY 0.2: v15.3,18.4 16.75,16.95 16.75,12.65 14.35,10.25 11.6,10.25 10.7,9.35 10.7,5.75 v10.5,5.55
  Bottom 0.2: v15.3,18.4 15.2,18.5 15.2,21.77 IC6.19
FET_A_L  (via drill 0.3)
  Top 0.2: IC1.23 15.7,30.65 15.45,30.4 v15.2,30.4
  Bottom 0.2: IC6.2 15.07,30.53 v15.2,30.4
FET_A_LO  (via drill 0.3)
  Top 0.2: R12.2 10.55,4.65 v10.7,4.8
  SUPPLY 0.2: v17.6,23 16.65,22.05 16.65,17.65 17.15,17.15 17.15,12.45 14.55,9.85 11.8,9.85 11.1,9.15 11.1,5.2 v10.7,4.8
  Bottom 0.2: IC6.17 17.61,21.54 | 17.61,21.51 IC6.17 | v17.6,23 17.61,22.99 IC6.17
FET_A_VB
  Bottom 0.2: D3.C 14.6,17.35 13.8,18.15 13.8,19.4 13.12,20.07 C31.P$1 13.12,20.43 13.8,21.1 IC6.20
FET_A_VS  (via drill 0.3)
  SUPPLY 0.2: v14.5,18.4 14.5,18.3 15,17.8 15.3,17.8 16.35,16.75 16.35,12.85 14.2,10.7 9.9,10.7 9.15,9.95
  Bottom 0.2: 14.45,22.95 14.45,21.05 14.55,20.95 C31.P$2 14.5,20.25 v14.5,18.4 | IC6.18 16.34,22.31 15.7,22.95 14.45,22.95 | 14.45,22.95 13.7,22.95 12.9,23.75 R13.1
  other vias: 4.28,7.12 4.88,7.12 5.47,7.12 6.08,7.12 6.67,7.12 7.28,7.12 4.28,6.53 4.88,6.53 5.47,6.53 6.08,6.53 6.67,6.53 7.28,6.53 4.28,5.92 4.88,5.92 6.08,5.92 5.47,5.92 6.67,5.92 7.28,5.92 4.28,5.33 4.88,5.33 5.47,5.33 6.08,5.33 6.67,5.33 7.28,5.33 4.28,4.72 4.88,4.72 5.47,4.72 6.08,4.72 6.67,4.72 7.28,4.72
  pour Top (no thermals): 3.35,9.8 7.7,9.8 7.7,3.52 3.35,3.52
  pour Bottom (no thermals): 0,0 0,5.35 3.1,5.35 3.1,7.45 3.65,7.45 7.55,7.4 7.55,3.75 4,3.75 4,1.85 3.2,1.85 3.2,0
  pour SUPPLY: 4.1,10 9.25,10 9.25,3.8 4.1,3.8
FET_B_H  (via drill 0.3)
  Top 0.2: 13.75,25.1 v14,25.35 13.65,25 10.1,25 10,25.1 IC1.42
  Bottom 0.2: IC6.3 16.35,31.54 16.35,30.45 15.7,29.8 14.75,29.8 14.2,29.25 14.2,25.55 v14,25.35
FET_B_HO  (via drill 0.3)
  Top 0.2: R16.2 17.7,6.15 16.95,6.9 v16.95,7.05
  SUPPLY 0.2: v20.15,20.9 20.35,20.65 20.35,19.95 20.15,19.75 20.15,18.2 17.95,16 17.95,12.05 15.9,10 15.9,8.1 v16.95,7.05
  Bottom 0.2: v20.15,20.9 20.15,20.85 IC6.15
FET_B_L  (via drill 0.3)
  Top 0.2: IC1.26 14.2,30.1 15.1,29.2 v15.2,29.2
  Bottom 0.2: IC6.4 17.57,31.1 15.68,29.2 v15.2,29.2
FET_B_LO  (via drill 0.3)
  Top 0.2: R17.2 18.25,5.35 18.25,6.55 v17.75,7.05
  SUPPLY 0.2: v17.75,7.05 17.75,7.15 17.2,7.7 16.9,7.7 16.3,8.3 16.3,9.8 18.35,11.85 18.35,15.8 20.6,18.05 20.6,19 22.1,20.5 22.35,20.5 v22.7,20.85
  Bottom 0.2: v22.7,20.85 22.69,20.96 IC6.13
FET_B_VB
  Bottom 0.2: IC6.16 18.88,21.53 17.95,20.6 17.93,20.6 arc90 C33.P$1 17.57,19.98 18.15,19.4 18.15,17.55 17.8,17.2 16.82,17.2 D4.C
FET_B_VS  (via drill 0.3)
  Top 0.2: Q4.6D v14.12,7.12
  SUPPLY 0.2: v19.7,20.25 19.75,18.4 17.55,16.2 17.55,12.25 14.56,9.26 Q3.3S | 15.35,7.15 v15.32,7.12
  Bottom 0.2: 19.5,23.65 19.5,21.05 19.1,20.65 C33.P$2 v19.7,20.25 | IC6.14 21.42,22.63 20.4,23.65 19.5,23.65 | R18.1 10.6,22.75 10.95,23.1 10.95,24 11.25,24.3 12.95,24.3 13.9,23.35 15.3,23.35 15.6,23.65 19.5,23.65
  other vias: 13.53,7.12 14.72,7.12 12.93,6.53 13.53,6.53 14.12,6.53 14.72,6.53 15.32,6.53 11.72,5.92 12.32,5.92 12.93,5.92 14.12,5.92 13.53,5.92 14.72,5.92 15.32,5.92 11.72,5.33 15.32,5.33 11.72,4.72 15.32,4.72 11.72,4.12 15.32,4.12 12.32,5.33 12.93,5.33 13.53,5.33 14.12,5.33 14.72,5.33 14.72,4.72 14.12,4.72 13.53,4.72 12.93,4.72 12.32,4.72 12.32,4.12 12.93,4.12 13.53,4.12 14.12,4.12 14.72,4.12 12.62,3.62 13.22,3.62 13.82,3.62 14.43,3.62
  pour Top (no thermals): 10.62,9.8 15.72,9.8 15.72,3.52 10.62,3.52
  pour Bottom (no thermals): 11.5,6.12 12.62,6.12 12.65,6.58 13.45,7.35 15.5,7.35 15.5,3.9 11.5,3.9
  pour SUPPLY: 9.95,3.8 17.4,3.8 17.4,10 9.95,10
FET_C_H  (via drill 0.3)
  Top 0.2: IC1.43 14.4,24.6 v14.55,24.75
  Bottom 0.2: IC6.5 18.88,31.13 18.35,30.6 17.65,30.6 15.65,28.6 15.05,28.6 14.6,28.15 14.6,24.75 v14.55,24.75
FET_C_HO  (via drill 0.3)
  Top 0.2: R20.2 25.7,6.35 v25.5,6.55
  SUPPLY 0.2: v25.5,6.55 24.55,7.5 24.55,9.95 25.4,10.8 25.4,24.9 24.5,25.8 24.5,26.05 24,26.55 v24,27
  Bottom 0.2: IC6.9 23.96,30.66 23.45,30.15 23.45,27.3 23.75,27 v24,27
FET_C_L  (via drill 0.3)
  Top 0.2: IC1.27 13.7,29.85 15.2,28.35 v15.2,27.9
  Bottom 0.2: IC6.6 20.15,31.15 19.2,30.2 17.85,30.2 15.85,28.2 15.5,28.2 v15.2,27.9
FET_C_LO  (via drill 0.3)
  Top 0.2: R21.2 26.35,5.25 26.35,6.5 v26.3,6.55
  SUPPLY 0.2: v26.3,6.55 26.3,6.45 25.8,5.95 25.15,5.95 24.15,6.95 24.15,10.15 25,11 25,24.7 v23.9,25.8
  Bottom 0.2: IC6.7 21.42,30.37 21.1,30.05 21.1,26.05 21.7,25.45 23.55,25.45 v23.9,25.8 23.8,25.7
FET_C_VB  (via drill 0.3)
  Top 0.2: C34.P$1 25.2,30.02 v25.23,30.05
  Bottom 0.2: IC6.10 v25.23,30.05 25.23,24 24.88,23.65 22.35,23.65 22.05,23.35 22.05,21.15 21.75,20.85 21.15,20.85 19.8,19.5 18.75,19.5 18.55,19.3 18.55,17.32 D5.C
FET_C_VS  (via drill 0.3)
  Top 0.2: Q6.8D 19.73,7.33 v19.73,7.08 | C34.P$2 25.2,27.05 24.55,26.4 22.5,26.4 v22.2,26.45
  SUPPLY 0.2: v19.73,7.08 19.55,7.25 | 18.75,9.9 18.75,15.6 21,17.85 21,18.8 22.3,20.1 22.8,20.1 23.35,20.65 23.35,23.8 22.2,24.95 v22.2,26.45 19.4,29.25 18.8,29.25 18.15,28.6 14.25,28.6 13.5,27.85 11.95,27.85 v11.3,27.2
  Bottom 0.2: v22.2,26.45 22.95,27.2 22.95,30.15 22.69,30.41 IC6.8 | v11.3,27.2 11.6,27.5 R22.1
  other vias: 20.32,7.08 20.93,7.08 21.52,7.08 22.12,7.08 22.73,7.08 23.32,7.08 19.73,6.47 20.32,6.47 20.93,6.47 21.52,6.47 22.12,6.47 22.73,6.47 23.32,6.47 19.73,5.88 20.32,5.88 20.93,5.88 22.12,5.88 21.52,5.88 22.73,5.88 23.32,5.88 19.73,5.28 20.32,5.28 20.93,5.28 21.52,5.28 22.12,5.28 22.73,5.28 23.32,5.28 19.73,4.67 20.32,4.67 20.93,4.67 21.52,4.67 22.12,4.67 22.73,4.67 23.32,4.67 19.73,4.08 20.32,4.08 20.93,4.08 22.12,4.08 21.52,4.08 22.73,4.08 23.32,4.08
  pour Top (no thermals): 23.75,3.5 19.3,3.5 19.3,9.8 23.75,9.8
  pour Bottom (no thermals): 19.5,3.77 19.5,7.3 24.75,7.3 24.75,7.1 26.45,7.1 26.45,3.77
  pour SUPPLY: 18.05,3.8 27,3.8 27,10 18.05,10
GND  (via drill 0.3)
  Top 0.2: IC3.2 1.97,38.05 | IC1.47 8.15,22.6 | 7.47,21.93 C8.P$2 | IC1.12 IC1.11 IC1.10 IC1.9 v19.1,26.1 | v24.1,28.68 C3.1 R1.2 | 23.7,29.85 C4.P$1 | IC1.31 11.7,32.4 11.5,32.6 C7.1 | IC5.7 IC5.6 IC5.5 | C2.1 v25.85,26.55 | IC1.18 18.2,30.55 17.55,29.9
  Bottom 0.2: C11.2 6,39.2 | C29.P$1 1.3,25.02 | IC7.2 7.05,12.5 6.75,12.8 arc-90 6.65,12.9 6.65,13.85 | R19.1 C32.1 | C30.1 C24.1 R10.1 | IC2.2 21.55,16.8
  Bottom 0.4: C14.2 25.75,20.55 26.1,20.9 v26.1,21.55 25.75,21.9 IC6.11
  other vias: 3.7,38.3 8.05,22.45 26.2,24.1 9.18,32.6 4.67,26.93 5.22,26.93 17.45,18 3.65,35.75 1.3,32.85 1,21.15 1,21.8 1.65,21.15 1.65,21.8 2.3,21.15 2.3,21.8 2.95,21.15 2.95,21.8 2.6,22.35 2.6,23 2.6,23.65 3.15,22.35 3.15,23 3.15,23.65 17.68,29.18 22.75,16.85 20,15.5 22.8,19.15 23.4,19.8 24.1,27.88 24.15,29.43 17.15,24.5 18,26.25 9.7,20 3.7,39.15 20.43,30.32 26.23,29.07 13.6,15.7 11.18,32.7 3.65,34.8 8.35,18.2 4.9,17.8 4.3,17.8 5.5,17.8 4.9,18.35 4.3,18.35 5.5,18.35 8.85,15.9 6.65,18.35 6.65,18.95
  pour gnd: 0,0 0,40 8,40 8,33 27,33 27,0
  pour Top (no thermals): 4.45,27.75 4.45,26.75 5.35,26.75 5.83,27.23 5.83,27.8 4.45,27.8
  pour Bottom (rank 3, no thermals): -0.05,13.7 0,24.25 5.9,24.15 5.85,13.6
  pour Top (rank 3): 0,15.3 0,40.1 8,40.1 8,33 27,33 27,15.3
  pour Bottom (rank 3): 0,13.65 0,40 8,40 8,33 27,33 27,13.65
  pour Top (no thermals): 5.7,16.55 4.1,16.55 4.1,18.55 5.7,18.55
GNDD  (via drill 0.3)
  Top 0.2: CON2.4 20.38,33.95 | 10.86,34.39 v10.7,34.55
  Bottom 0.6: CON5.4 15.22,35.65 v15,35.88 v14.45,35.88 | CON4.4 24.12,36.45 v24.1,36.45
  other vias: 18.95,34.02 19.55,34.02 10.7,35.12 26.05,34.95 25.05,34.95 25.55,35.55 14.8,38.6 11.4,38.65 10.8,37.15 19.65,37.2
  pour Bottom: 8.9,40 27,40 27,33.55 8.9,33.55
  pour Top: 8.9,40 27,40 27,33.55 8.9,33.55
  pour gnd: 8.9,40 27,40 27,33.55 8.9,33.55
I2C_SCL  (via drill 0.3)
  Top 0.2: IC1.61 17.2,19.15 18.98,17.38 IC5.2 | IC5.2 20.73,17.38 | IC5.2 21.62,17.38 22.05,16.95 22.05,16.6 v22.75,15.9
  Bottom 0.2: v22.75,15.9 IC2.1 20.5,15.9 19.9,16.5 19.9,17.3 R3.2
I2C_SDA  (via drill 0.3)
  Top 0.2: IC1.62 17.7,19.35 19.02,18.02 IC5.1 22.57,18.02 v22.8,17.8
  Bottom 0.2: v22.8,17.8 IC2.3 20.6,17.8 R2.2
N$1
  Top 0.2: CON1.2 R5.1
N$2
  Top 0.2: CON1.3 4.3,30.6 3.35,31.55 3.35,33.65 3.65,33.95 5.8,33.95 6.75,33 R6.1
N$3
  Top 0.2: IC1.37 8.45,27.6 R25.2
N$4
  Top 0.2: Q2.4G 7.38,2.68 8.65,3.95 R12.1
N$5
  Top 0.2: Q3.4G 16.2,8.46 16.2,6.6 16.7,6.1 R16.1
N$6  (via drill 0.3)
  Top 0.2: R23.1 6.35,25.9 6,26.25 v6,26.75
  Bottom 0.2: LED1.B 1.57,32.02 1.7,31.9 1.7,30.65 2.1,30.25 3.35,30.25 6,27.6 v6,26.75
N$7  (via drill 0.3)
  Top 0.2: R25.1 7.35,28.85 v7.35,29.15
  Bottom 0.2: v7.35,29.15 6.75,28.55 5.65,28.55 3.02,31.18 LED1.R | 2.42,31.4 LED1.R | 2.52,31.18 LED1.R
N$8
  Top 0.2: Q4.4G 15.4,2.65 16.7,3.95 R17.1
N$9
  Top 0.2: IC1.8 21.4,25.6 21.6,25.8 21.6,26.85 R1.1
N$10
  Bottom 0.2: IC2.5 25,15.9 R26.2
N$11
  Top 0.2: Q5.4G 24.2,8.49 24.2,6.3 R20.1
N$12
  Top 0.2: IC1.38 R24.2
N$13
  Bottom 0.2: R14.SENSE2 3.7,12.45 3.9,12.25 4.7,12.25 5,12.55 5,13.35 arc-90 IC7.5
N$14
  Top 0.2: Q1.4G 8.15,8.49 8.15,6.35 R11.1
N$15
  Bottom 0.2: R14.SENSE1 3.7,10.55 4.55,11.4 4.95,11.4 arc90 IC7.4
N$16
  Top 0.2: IC1.5 21.38,24.1 22.18,23.3 23.2,23.3 24.27,22.43 X1.3 | 24.27,22.45 X1.3 | C1.2 25.75,22.35 X1.3
N$17
  Top 0.2: Q6.4G 23.43,2.63 24.7,3.9 R21.1
N$18
  Top 0.2: IC1.39 8.5,26.6 R23.2
N$19
  Bottom 0.6: CON5.1 11.47,33.58 12.3,32.75 16.3,32.75 17,33.45 17,34.25 17.65,34.9 20.38,34.9 CON4.1
N$20
  Bottom 0.2: CON4.2 21.62,35.08 21,35.7 19.8,35.7 19.6,35.5 17.2,35.5 16.3,34.6 16.3,33.7 15.95,33.35 13.1,33.35 12.72,33.73 CON5.2 | 12.72,34.83 CON5.2 | CON5.2 12.72,35.38 12.4,35.7 10.35,35.7 10,35.35 7.18,35.35 IC4.7
N$21
  Top 0.2: IC1.6 22.43,24.6 X1.1 | 22.25,24.65 X1.1 | X1.1 22.48,24.57 | C2.2 25.3,24.35 25.3,24.05 24.9,23.65 23.48,23.65 X1.1
N$22
  Top 0.6: CON2.1 24.12,33.98 22.9,32.75 20.88,32.75 20.48,33.15 18.65,33.15 17.7,34.1 15.22,34.1 CON3.1
N$23
  Top 0.2: CON2.2 22.88,34.02 | 22.88,34.83 CON2.2 | CON2.2 22.88,33.62 22.6,33.35 21.32,33.35 21,33.67 21,35.48 20.77,35.7 19.8,35.7 19.57,35.48 16.62,35.48 15.6,36.5 14.15,36.5 13.8,36.15 13.8,34.54 CON3.2 13.97,33.83 13.5,33.35 11.05,33.35 9.55,34.85 5.75,34.85 5.65,34.95 5.65,37.35 6.15,37.85 7.15,37.85 IC3.7
N$24
  Bottom 0.2: CON4.3 22.88,35.23 22,36.1 19.6,36.1 19.4,35.9 16.4,35.9 15.8,36.5 14.18,36.5 13.78,36.1 | 13.78,36.1 10.15,36.1 9.85,35.8 8.85,35.8 8.06,36.59 IC4.6 | CON5.3 13.78,34.74 13.78,36.1
N$25
  Top 0.2: 12.72,35.17 CON3.3 12.72,35.73 | CON2.3 21.62,35.48 21,36.1 19.6,36.1 19.4,35.9 16.8,35.9 15.8,36.9 13.9,36.9 12.72,35.73 | 12.72,35.73 12.7,35.7 8.95,35.7 7.89,36.76 IC3.6
N$26  (via drill 0.3)
  Top 0.2: R24.1 6.22,27.68 6.22,28.73 6.45,28.95 v6.45,29.15
  Bottom 0.2: v6.45,29.15 5.65,29.15 2.77,32.02 LED1.G 2.42,31.8
N$27
  Top 0.2: IC1.53 13.2,18.65 14.55,17.3 TP2.P$1
N$28  (via drill 0.3)
  Top 0.2: IC1.36 10,28.1 10.15,27.95 10.15,26.6 v10.65,26.1 | TP5.P$1 10.7,17.7 v10.7,19.1
  SUPPLY 0.2: v10.7,19.1 10.7,26.15 v10.65,26.1
N$29
  Top 0.2: IC1.52 12.7,17.7 TP1.P$1
SENSE_A  (via drill 0.3)
  Top 0.2: IC1.15 19.8,29.1 19.35,28.65 v19.05,28.65
  SUPPLY 0.2: v12.7,22.2 12.85,22.2 19.05,28.4 v19.05,28.65
  Bottom 0.2: R13.2 11.75,22.2 | 11.75,22.2 R10.2 C24.2 | v12.7,22.2 11.75,22.2
SENSE_B  (via drill 0.3)
  Top 0.2: IC1.16 19.15,29.6 18.45,28.9 18.45,28.35 16.95,26.85 16,26.85 v15.75,26.6
  Bottom 0.2: C30.2 R15.2 9,22.75 10,23.75 R18.2 10.1,23.75 11.05,24.7 13.15,24.7 14.1,23.75 15.05,23.75 15.55,24.25 15.55,26.4 v15.75,26.6
SENSE_C  (via drill 0.3)
  Top 0.2: IC1.17 18.7,29.98 v18.32,29.6
  SUPPLY 0.2: v12.8,29.7 12.9,29.8 18.12,29.8 v18.32,29.6
  Bottom 0.2: C32.2 R19.2 | R22.2 12.1,28.55 R19.2 | R19.2 v12.8,29.7
SENSE_CURRENT  (via drill 0.3)
  Top 0.2: IC1.21 16.7,30.7 16.55,30.55 v16.55,27.95
  Bottom 0.2: 16.35,27.95 v16.55,27.95 16.25,27.95 15.15,26.85 15.15,24.45 14.85,24.15 14.3,24.15 13.35,25.1 10.85,25.1 10.05,24.3 8.1,24.3 7.45,23.65 7.45,17.65 R7.2 7.6,16.77 C28.P$2
SENSE_VIN  (via drill 0.3)
  Top 0.2: v13.2,28.45 14.4,27.25 16.7,27.25 17.15,27.7 17.15,28.4 16.95,28.6 16.95,30.3 17.2,30.55 IC1.20 | C15.2 R8.1 R9.1 6.25,23.5 v6.15,23.5
  Bottom 0.2: v13.2,28.45 13.2,26.6 12.1,25.5 10.65,25.5 9.85,24.7 7.9,24.7 6.7,23.5 v6.15,23.5
SWCLK  (via drill 0.3)
  Top 0.2: IC1.49 11.2,19.75 10.3,19.75 9.35,18.8 7.5,18.8 7.3,19 7.3,19.45 6.85,19.9 6.85,23.8 6.55,24.1 5.8,24.1 5.35,24.55 v4.4,24.55 | CON1.5 5.08,28.55 4.47,28.55 3.8,27.88 v3.75,27.88
  Bottom 0.2: v3.75,27.88 3.55,27.68 3.55,25.3 4.3,24.55 v4.4,24.55
SWDIO  (via drill 0.3)
  Top 0.2: IC1.46 8.15,23.1 6.75,24.5 5.97,24.5 5.17,25.3 v4.4,25.3 | CON1.4 4.53,29.6 3.75,28.82 v3.75,28.77
  Bottom 0.2: v3.75,28.77 4.35,28.18 4.35,27.57 3.95,27.18 3.95,25.75 v4.4,25.3
TSENS_OS
  Top 0.2: IC5.3 16.38,16.73 15.95,17.15 15.95,18.85 15.7,19.1 15,19.1 14.7,19.4 IC1.56
USART1_RX/PWM
  Top 0.2: R6.2 7.95,32.8 8.5,32.25 8.5,31.57 9.53,30.55 10.25,30.55 14.88,25.93 16.2,25.93 | IC1.59 16.2,25.93 | IC1.14 19.9,28.6 19.35,28.05 18.75,28.05 17.15,26.45 16.73,26.45 16.2,25.93
USART1_TX
  Top 0.2: R5.2 9.35,30.15 10.05,30.15 15.7,24.5 IC1.58
VBAT  (via drill 0.3)
  Top 0.2: C20.P$2 25.68,12.95 25.65,12.95 | R9.2 6.25,21.65 v5.7,21.1
  Bottom 0.2: 4.9,23.35 C27.P$1 | C35.+ 9.38,10.88 C18.P$2
  Bottom 0.4: IC6.12 C14.1 23.95,20.25 24.35,19.85 25.3,19.85 26.3,18.85 26.3,14.34
  Bottom 0.5: 4.9,23.35 4.9,23.5 7.1,25.7 IC8.3
  Bottom 0.6: C27.P$1 4.6,23.07 v4.6,21.1 | v4.6,21.1 v5.7,21.1 v4.05,21.1 v4.6,21.1 | v4.6,21.1 v5.15,21.1
  other vias: 11.3,13.05 11.85,13.05 12.4,13.05 12.95,13.05 13.5,13.05 14.05,13.05 14.6,13.05 15.15,13.05 15.7,13.05 11.3,14.15 11.85,14.15 12.4,14.15 12.95,14.15 13.5,14.15 11.3,13.6 11.85,13.6 12.4,13.6 12.95,13.6 13.5,13.6 14.05,13.6 14.6,13.6 15.15,13.6 15.7,13.6 19.35,13.05 19.9,13.05 20.45,13.05 21,13.05 21.55,13.05 22.1,13.05 22.65,13.05 23.2,13.05 19.9,14.15 20.45,14.15 21,14.15 21.55,14.15 22.1,14.15 22.65,14.15 23.2,14.15 19.35,13.6 19.9,13.6 20.45,13.6 21,13.6 21.55,13.6 22.1,13.6 22.65,13.6 23.2,13.6 9.1,13.05 9.65,13.05 10.2,13.05 10.75,13.05 9.1,14.15 9.65,14.15 10.2,14.15 10.75,14.15 9.1,13.6 9.65,13.6 10.2,13.6 10.75,13.6 19.35,14.15
  pour Top (rank 2, no thermals): 27,14.75 6.05,14.75 6.05,21.3 3.75,21.3 3.75,20.35 0,20.35 0,12.5 3.25,12.5 3.25,10.65 27,10.65
  pour Bottom (no thermals): 26.5,10.55 7.75,10.55 8.55,11.4 8.55,14.75 26.5,14.75
  pour SUPPLY (rank 2): 27,14.65 0,14.65 0,10.55 27,10.55
  pour Bottom (no thermals): 5.9,19.25 3.8,19.25 3.8,23.8 5.9,23.8
VDD_3V3  (via drill 0.3)
  Top 0.2: 2.87,36.77 IC3.3 4.54,36.76 4.55,36.75 | IC1.32 10.15,31.55 | 10.15,31.55 C7.2 | 8.9,20.9 C8.P$1 8.93,22.1 IC1.48 9.75,22.1 | 8.9,20.9 C9.1 | IC1.64 18.7,22.1 | 18.7,22.1 v18.7,23 | IC1.13 21.7,28.1 22.23,28.62 C3.2 v22.25,29.5 C4.P$2 | 10.15,31.55 9.35,31.55 v9.28,31.62 | IC1.19 17.7,32.58 v17.88,32.75 | IC1.1 18.7,22.1 | 21.15,22.1 IC1.1 | 8.9,20.9 8.9,21.25 v9.7,21.25 | C5.2 20.8,20.45 20.8,22.1 IC1.1 | v4.95,38.45 4.95,38.1 4.55,37.7 4.55,36.75 | 4.55,36.75 v4.55,36.1 | 9.9,18.4 v10.1,18.6 9.3,17.8 TP4.P$1
  Top 0.3: C13.1 25.74,18.02 IC5.8 24.43,18.02 24,17.6 v24,16.9
  Bottom 0.2: 2.2,28.9 IC8.4 | IC8.4 2.05,27.85 1.61,27.7 | 1.61,27.7 v0.7,27.38 v0.7,28.57 | LED1.+ 0.97,29.43 v0.7,29.18 | 2.75,27.7 1.61,27.7 | C29.P$2 2.85,28 IC8.4 | v17.88,32.75 17.95,32.83 18.75,32.83 C6.2 | R3.1 R2.1 21,18.95 21.55,18.4 23.05,18.4 23.45,18 24,18 IC2.4 | IC7.1 8.2,13.45 v8.2,15.05 | IC4.3 0.81,36.59 0.51,36.89 0.51,38.26 1.5,39.25 C12.1 | C11.1 v4.95,38.45
  Bottom 0.3: IC4.3 4.07,36.59 v4.55,36.1 v4.55,33.25
  Bottom 0.4: 24.85,17.8 IC2.4 24,17.8 v24,16.9 | 24.85,17.8 C10.1 | R26.1 25.2,17.8 24.85,17.8
  Bottom 0.6: v5.1,33.25 v4.55,33.25 v4,33.25
  other vias: 0.7,27.98 10.75,28.3 10.75,27.75
  pour SUPPLY (rank 3, no thermals): 0,40 27,40 27,15.15 0,15.15
  pour Bottom (no thermals): 1.6,26.2 0.4,26.2 0.4,29.8 1.45,29.8 1.6,29.8
  pour Bottom (no thermals): 9.5,28.5 9.5,27.5 10.95,27.5 10.95,28.5
  pour Top (no thermals): 5.85,32.4 3.8,32.4 3.8,33.5 5.85,33.5

### Text on the board
tPlace: CAN1 | PX4ESC | OREL V1.0
bPlace: CAN2